# Altium schematic sheet Top.SchDoc
size A
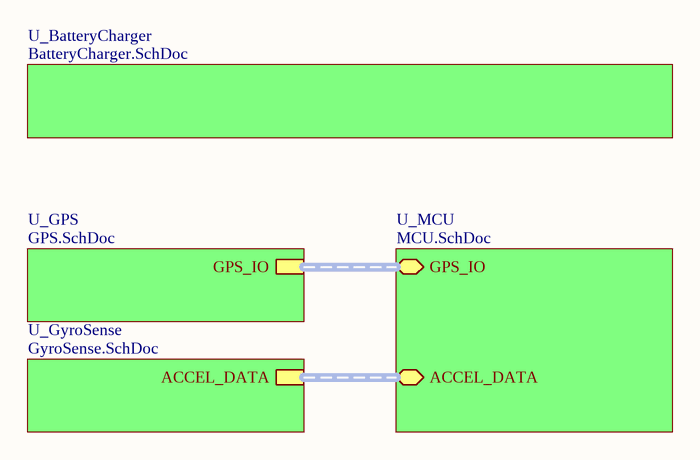
[diagram p0: Top.SchDoc]

## Sub-sheets
U_BatteryCharger = BatteryCharger.SchDoc: no entries
U_GPS = GPS.SchDoc: GPS_IO (harness GPS_IO)
U_GyroSense = GyroSense.SchDoc: ACCEL_DATA (harness ACCEL)
U_MCU = MCU.SchDoc: GPS_IO (bidir, harness GPS_IO), ACCEL_DATA (bidir, harness ACCEL)

## Buses and harness runs
harness sheet U_GPS/GPS_IO = sheet U_MCU/GPS_IO
harness sheet U_GyroSense/ACCEL_DATA = sheet U_MCU/ACCEL_DATA